# EAGLE schematic F4BY_V2.1.5 (EAGLE 6.3)
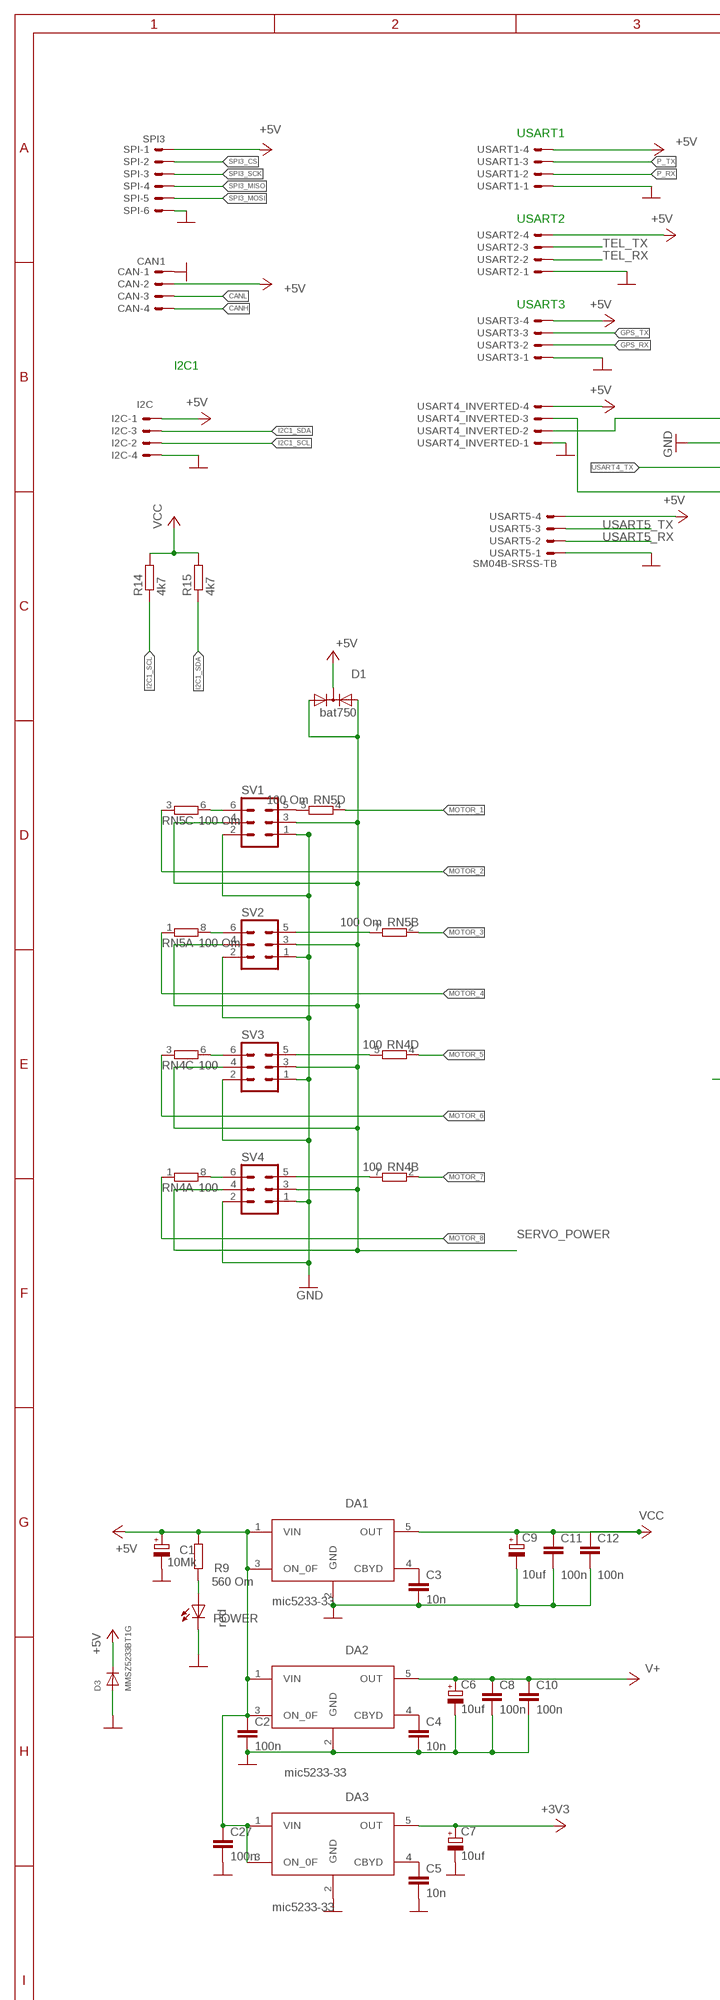
[diagram p0: schematic, sheet 1, part 1 of 2]
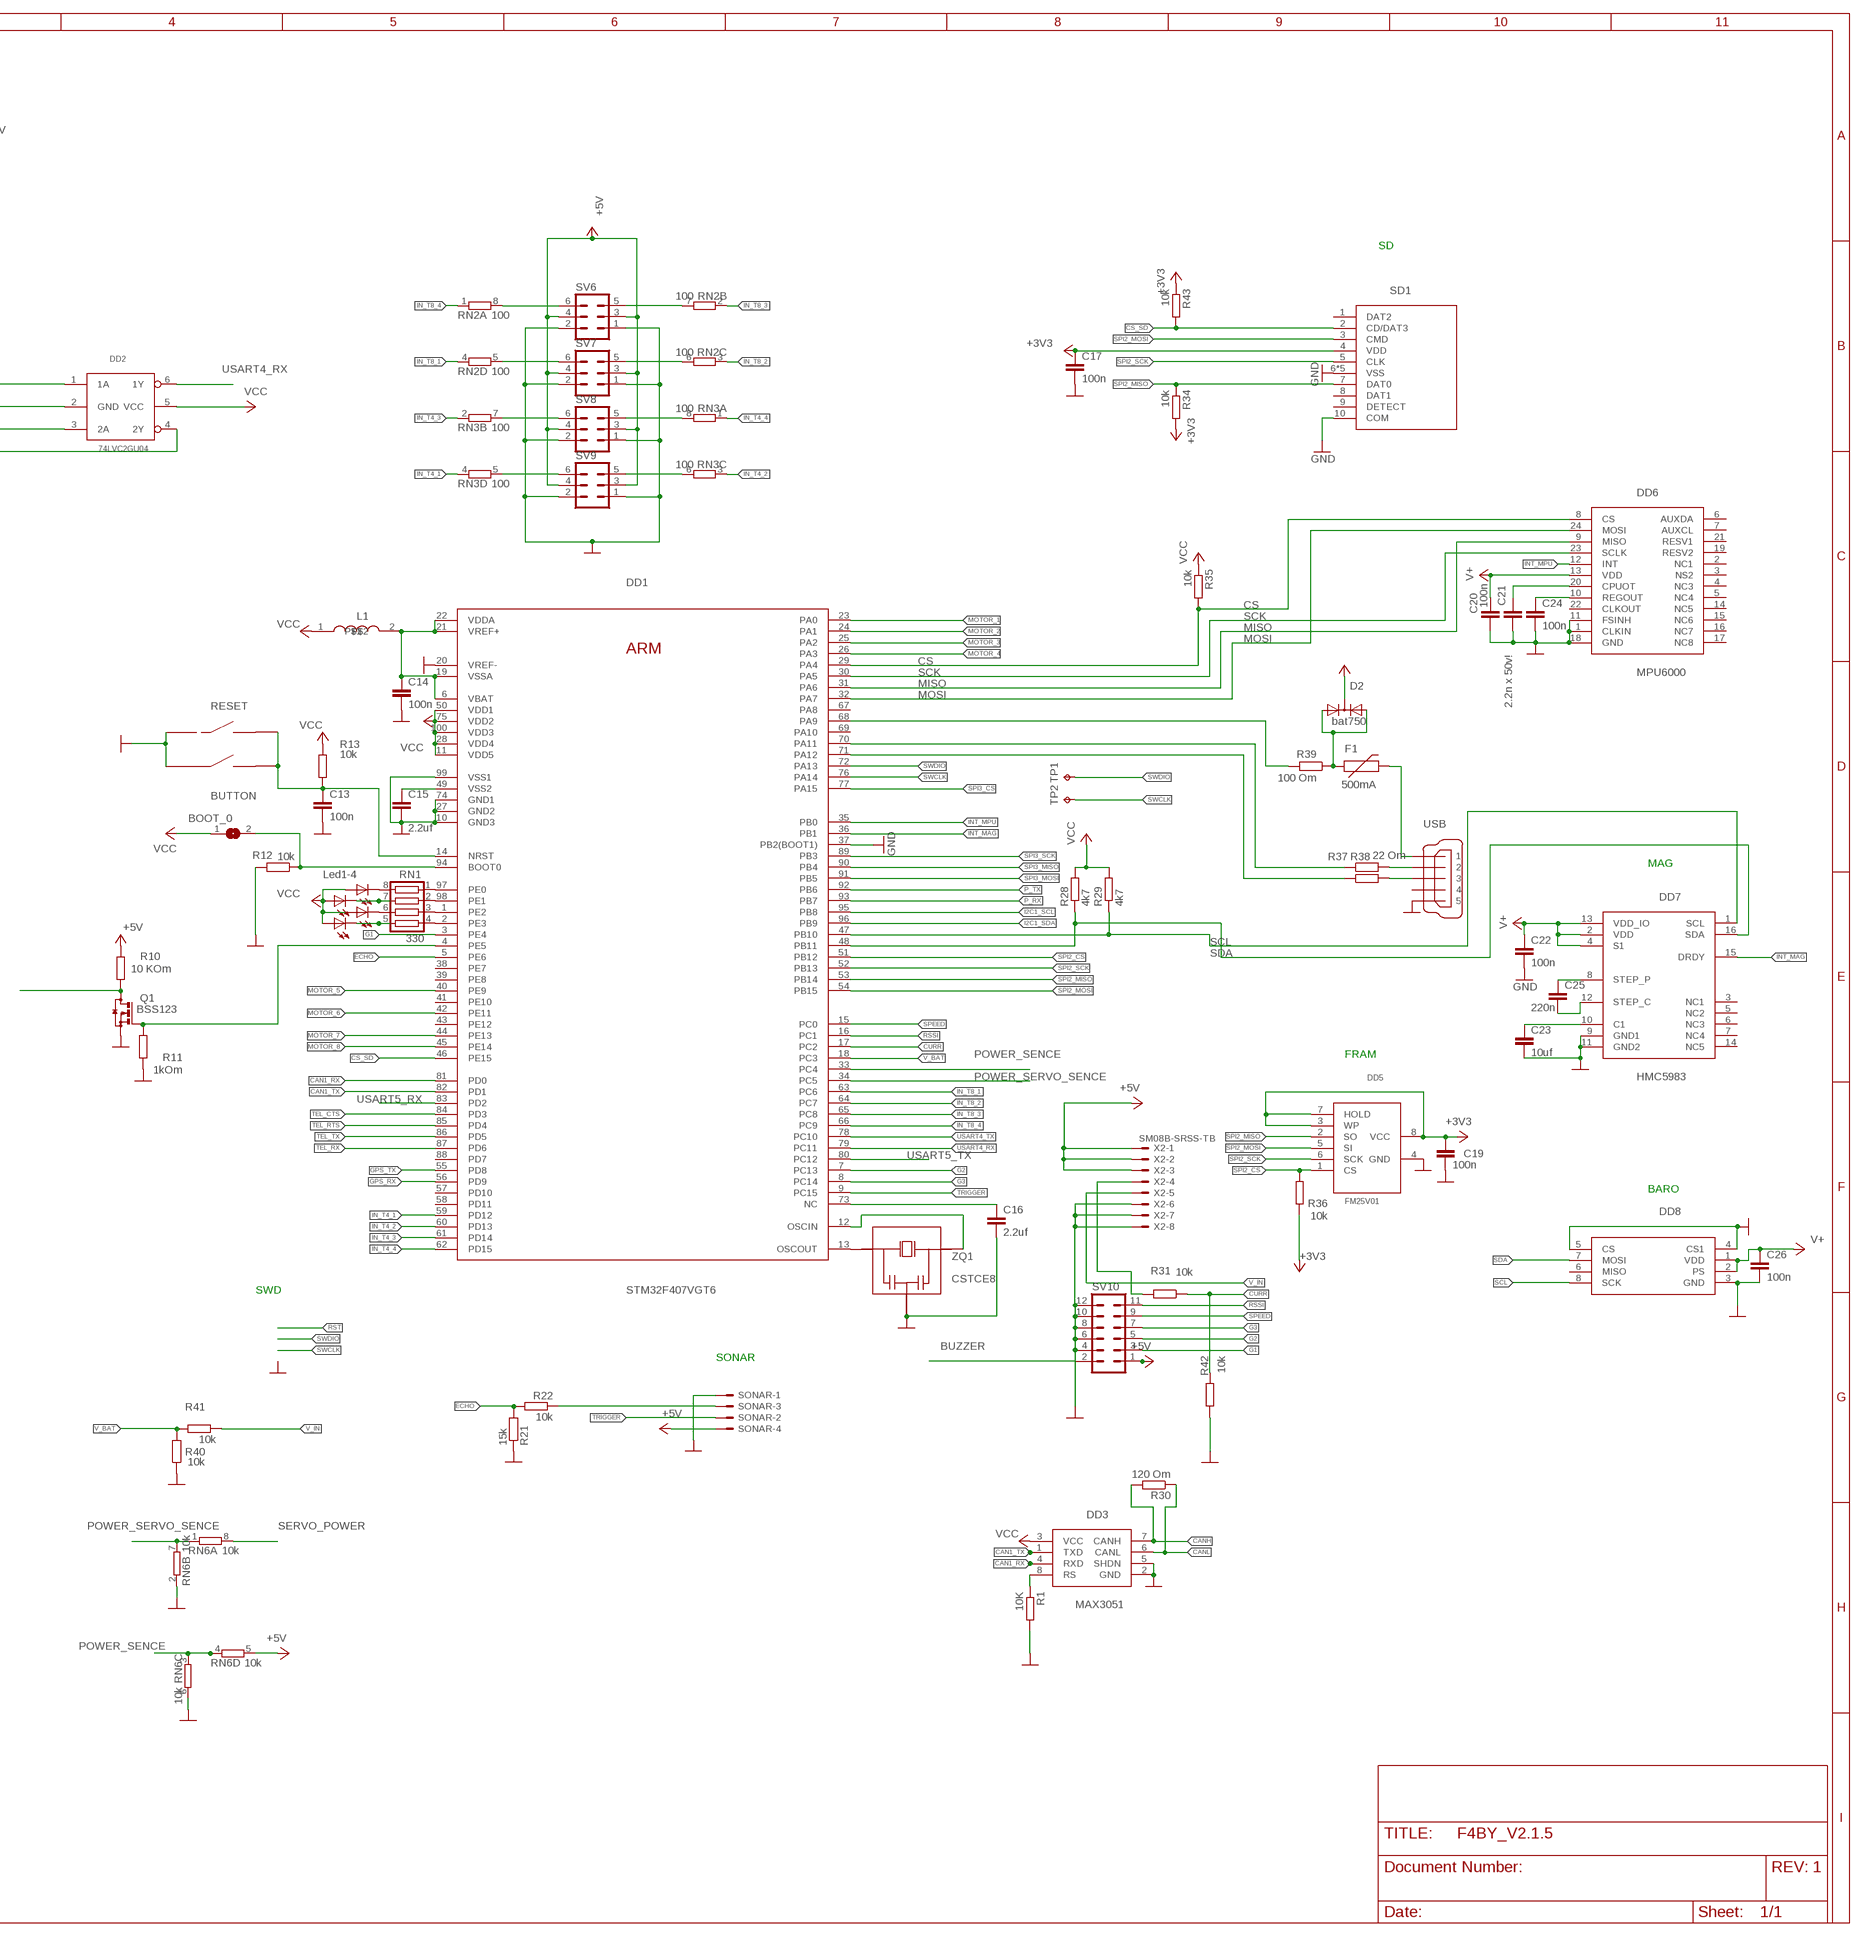
[diagram p1: schematic, sheet 1, part 2 of 2]

## Parts
BOOT_0  SJ  [SJ]
C1  10Mk  CPOL-EUA/3216-18W  [A/3216-18W]
C2  100n  C-EUC0603K  [C0603K]
C3  10n  C-EUC0603K  [C0603K]
C4  10n  C-EUC0603K  [C0603K]
C5  10n  C-EUC0603K  [C0603K]
C6  10uf  CPOL-EUA/3216-18W  [A/3216-18W]
C7  10uf  CPOL-EUA/3216-18W  [A/3216-18W]
C8  100n  C-EUC0603K  [C0603K]
C9  10uf  CPOL-EUA/3216-18W  [A/3216-18W]
C10  100n  C-EUC0603K  [C0603K]
C11  100n  C-EUC0603K  [C0603K]
C12  100n  C-EUC0603K  [C0603K]
C13  100n  C-EUC0603K  [C0603K]
C14  100n  C-EUC0603K  [C0603K]
C15  2.2uf  C-EUC0805  [C0805]
C16  2.2uf  C-EUC0805  [C0805]
C17  100n  C-EUC0603K  [C0603K]
C19  100n  C-EUC0603K  [C0603K]
C20  100n  C-EUC0603K  [C0603K]
C21  2.2n x 50v!  C-EUC0603K  [C0603K]
C22  100n  C-EUC0603K  [C0603K]
C23  10uf  C-EUC0805K  [C0805K]
C24  100n  C-EUC0603K  [C0603K]
C25  220n  C-EUC0603K  [C0603K]
C26  100n  C-EUC0603K  [C0603K]
C27  100n  C-EUC0603K  [C0603K]
CAN  CAN1  SM04B-SRSS-TB  [SM04B-SRSS-TB]
D1  bat750  DIODE-2AC|CASOT23  [SOT23]
D2  bat750  DIODE-2AC|CASOT23  [SOT23]
D3  MMSZ5233BT1G  ADAFRUIT_DIODESOD-123  [ADAFRUIT_SOD-123]
DA1  mic5233-33  3.3  [SOT23-5L]
DA2  mic5233-33  3.3  [SOT23-5L]
DA3  mic5233-33  3.3  [SOT23-5L]
DD1  STM32F407VGT6  STM32F407VET6  [LQFP100]
DD2  74LVC2GU04  [SOT363_PHILIPS]
DD3  MAX3051  [MAX3051]
DD5  FM25V01  W25X40  [SOIC8]
DD6  MPU6000  [JEDEC]
DD7  HMC5983  HMC5883L  [LCC-16]
DD8  MS5611-01BA03  [MS5611-01BA03]
F1  500mA  SPARKFUN_PTCSMD  [SPARKFUN_PTC-1206]
I2C  I2C  SM04B-SRSS-TB  [SM04B-SRSS-TB]
L1  FCM1608  [R0603]
LED1  LED1  LEDCHIPLED_0603  [CHIPLED_0603]
LED2  LED2  LEDCHIPLED_0603  [CHIPLED_0603]
LED3  LEDCHIPLED_0603  [CHIPLED_0603]
LED4  LEDCHIPLED_0603  [CHIPLED_0603]
POWER  red  LEDCHIPLED_0603  [CHIPLED_0603]
Q1  BSS123  [SOT23]
R1  10K  R-EU_R0402  [R0402]
R9  560 Om  R-EU_R0603  [R0603]
R10  10 KOm  R-EU_R0603  [R0603]
R11  1kOm  R-EU_R0603  [R0603]
R12  10k  R-EU_R0603  [R0603]
R13  10k  R-EU_R0603  [R0603]
R14  4k7  R-EU_R0603  [R0603]
R15  4k7  R-EU_R0603  [R0603]
R21  15k  R-EU_R0603  [R0603]
R22  10k  R-EU_R0603  [R0603]
R28  4k7  R-EU_R0603  [R0603]
R29  4k7  R-EU_R0603  [R0603]
R30  120 Om  R-EU_R0603  [R0603]
R31  10k  R-EU_R0603  [R0603]
R34  10k  R-EU_R0603  [R0603]
R35  10k  R-EU_R0603  [R0603]
R36  10k  R-EU_R0603  [R0603]
R37  22 Om  R-EU_R0603  [R0603]
R38  22 Om  R-EU_R0603  [R0603]
R39  100 Om  R-EU_R0603  [R0603]
R40  10k  R-EU_R0603  [R0603]
R41  10k  R-EU_R0603  [R0603]
R42  10k  R-EU_R0603  [R0603]
R43  10k  R-EU_R0603  [R0603]
RESET  BUTTON  [BUTTON]
RN1  330  CTS742C083  [CTS742C083]
RN2  100  4R-N0603-ARC  [0603-ARC]
RN3  100  4R-N0603-ARC  [0603-ARC]
RN4  100  4R-N0603-ARC  [0603-ARC]
RN5  100 Om  4R-N0603-ARC  [0603-ARC]
RN6  10k  4R-N0603-ARC  [0603-ARC]
SD1  MICROCD_MAIN  [MICROSD_MAIN]
SONAR  SM04B-SRSS-TB  [SM04B-SRSS-TB]
SPI  SPI3  SM06B-SRSS-TB  [SM06B-SRSS-TB]
SV1  MA03-2  [MA03-2]
SV2  MA03-2  [MA03-2]
SV3  MA03-2  [MA03-2]
SV4  MA03-2  [MA03-2]
SV6  MA03-2  [MA03-2]
SV7  MA03-2  [MA03-2]
SV8  MA03-2  [MA03-2]
SV9  MA03-2  [MA03-2]
SV10  MA06-2  [MA06-2]
TP1  TPTP08SQ  [TP08SQ]
TP2  TPTP08SQ  [TP08SQ]
USART1  USART1  SM04B-SRSS-TB  [SM04B-SRSS-TB]
USART2  SM04B-SRSS-TB  [SM04B-SRSS-TB]
USART3  SM04B-SRSS-TB  [SM04B-SRSS-TB]
USART4_INVERTED  SM04B-SRSS-TB  [SM04B-SRSS-TB]
USART5  SM04B-SRSS-TB  [SM04B-SRSS-TB]
USB  MINI-USB-32005-201  [32005-201]
X2  SM08B-SRSS-TB  [SM08B-SRSS-TB]
ZQ1  CSTCE8  [CSTCE8]

## Nets
+3V3: C7.+ C17.1 C19.1 DA3.5(OUT) DD5.3(WP) DD5.7(HOLD) DD5.8(VCC) R34.2 R36.1 R43.1 SD1.4(VDD)
+5V: C1.+ C2.1 C27.1 CAN.2 D1.3(C) D2.3(C) D3.C DA1.1(VIN) DA1.3(ON_0F) DA2.1(VIN) DA2.3(ON_0F) DA3.1(VIN) DA3.3(ON_0F) I2C.1 R9.2 R10.2 RN6.5 SONAR.4 SPI.1 SV6.3 SV6.4 SV7.3 SV7.4 SV8.3 SV8.4 SV9.3 SV9.4 SV10.1 USART1.4 USART2.4 USART3.4 USART4_INVERTED.4 USART5.4 X2.1 X2.2 X2.3
BUZZER: Q1.3(D) R10.1 SV10.2
CAN1_RX: DD1.81(PD0) DD3.4(RXD)
CAN1_TX: DD1.82(PD1) DD3.1(TXD)
CANH: CAN.4 DD3.7(CANH) R30.2
CANL: CAN.3 DD3.6(CANL) R30.1
CS: DD1.29(PA4) DD6.8(CS) R35.2
CS_SD: DD1.46(PE15) R43.2 SD1.2(CD/DAT3)
CURR: DD1.17(PC2) R31.1 R42.2
ECHO: DD1.5(PE6) R21.2 R22.2
G1: DD1.3(PE4) SV10.3
G2: DD1.7(PC13) SV10.5
G3: DD1.8(PC14) SV10.7
GND: C1.- C2.2 C3.2 C4.2 C5.2 C6.- C7.- C8.2 C9.- C10.2 C11.2 C12.2 C13.2 C14.2 C15.2 C16.2 C17.2 C19.2 C20.2 C21.2 C22.2 C23.2 C24.2 C26.2 C27.2 CAN.1 D3.A DA1.2(GND) DA2.2(GND) DA3.2(GND) DD1.10(GND3) DD1.20(VREF-) DD1.27(GND2) DD1.37(PB2(BOOT1)) DD1.74(GND1) DD1.99(VSS1) DD2.2(GND) DD3.2(GND) DD3.5(SHDN) DD5.4(GND) DD6.1(CLKIN) DD6.11(FSINH) DD6.18(GND) DD7.9(GND1) DD7.11(GND2) DD8.3(GND) DD8.4(CS1) DD8.5(CS) I2C.4 POWER.C Q1.2(S) R1.2 R11.1 R12.2 R21.1 R40.1 R42.1 RESET.1 RESET.3 RN6.2 RN6.6 SD1.6(VSS) SD1.10(COM) SD1.11(VSS) SD1.12(VSS) SD1.13(VSS) SD1.14(VSS) SONAR.1 SPI.6 SV1.1 SV1.2 SV2.1 SV2.2 SV3.1 SV3.2 SV4.1 SV4.2 SV6.1 SV6.2 SV7.1 SV7.2 SV8.1 SV8.2 SV9.1 SV9.2 SV10.4 SV10.6 SV10.8 SV10.10 SV10.12 USART1.1 USART2.1 USART3.1 USART4_INVERTED.1 USART5.1 USB.5 X2.6 X2.7 X2.8 ZQ1.2
GPS_RX: DD1.56(PD9) USART3.2
GPS_TX: DD1.55(PD8) USART3.3
I2C1_SCL: DD1.95(PB8) I2C.2 R14.1
I2C1_SDA: DD1.96(PB9) I2C.3 R15.1
IN_T4_1: DD1.59(PD12) RN3.4
IN_T4_2: DD1.60(PD13) RN3.3
IN_T4_3: DD1.61(PD14) RN3.2
IN_T4_4: DD1.62(PD15) RN3.1
IN_T8_1: DD1.63(PC6) RN2.4
IN_T8_2: DD1.64(PC7) RN2.3
IN_T8_3: DD1.65(PC8) RN2.2
IN_T8_4: DD1.66(PC9) RN2.1
INT_MAG: DD1.36(PB1) DD7.15(DRDY)
INT_MPU: DD1.35(PB0) DD6.12(INT)
MISO: DD1.31(PA6) DD6.9(MISO)
MOSI: DD1.32(PA7) DD6.24(MOSI)
MOTOR_1: DD1.23(PA0) RN5.4
MOTOR_2: DD1.24(PA1) RN5.3
MOTOR_3: DD1.25(PA2) RN5.2
MOTOR_4: DD1.26(PA3) RN5.1
MOTOR_5: DD1.40(PE9) RN4.4
MOTOR_6: DD1.42(PE11) RN4.3
MOTOR_7: DD1.44(PE13) RN4.2
MOTOR_8: DD1.45(PE14) RN4.1
N$1: DD1.13(OSCOUT) ZQ1.1
N$2: DD1.98(PE1) RN1.2
N$3: DD1.1(PE2) RN1.3
N$4: POWER.A R9.1
N$5: DD1.2(PE3) RN1.4
N$6: DD1.97(PE0) RN1.1
N$7: LED3.C RN1.7
N$8: LED4.C RN1.8
N$9: RN2.8 SV6.6
N$10: LED2.C RN1.6
N$11: DD1.68(PA9) R39.2
N$12: DD1.12(OSCIN) ZQ1.3
N$13: DD3.8(RS) R1.1
N$14: LED1.C RN1.5
N$15: C3.1 DA1.4(CBYD)
N$16: RN2.7 SV6.5
N$17: RN2.5 SV7.6
N$18: RN3.7 SV8.6
N$19: C21.1 DD6.20(CPUOT)
N$21: RN3.5 SV9.6
N$22: C24.1 DD6.10(REGOUT)
N$23: RN3.6 SV9.5
N$24: RN3.8 SV8.5
N$25: RN2.6 SV7.5
N$26: C23.1 DD7.10(C1)
N$27: C25.2 DD7.12(STEP_C)
N$28: C25.1 DD7.8(STEP_P)
N$29: RN5.5 SV1.5
N$30: F1.2 USB.1
N$31: DD2.1(1A) USART4_INVERTED.2
N$33: RN5.6 SV1.6
N$34: R31.2 X2.4
N$35: C4.1 DA2.4(CBYD)
N$36: C5.1 DA3.4(CBYD)
N$38: DD2.4(2Y) USART4_INVERTED.3
N$39: RN5.7 SV2.5
N$40: C14.1 DD1.6(VBAT) DD1.19(VSSA) DD1.21(VREF+) DD1.22(VDDA) L1.2
N$41: DD1.70(PA11) R37.1
N$42: DD1.71(PA12) R38.1
N$43: R37.2 USB.2
N$44: R38.2 USB.3
N$45: RN5.8 SV2.6
N$46: RN4.5 SV3.5
N$47: D2.1(A1) D2.2(A2) F1.1 R39.1
N$48: RN4.7 SV4.5
N$49: RN4.6 SV3.6
N$50: RN4.8 SV4.6
N$51: DD1.4(PE5) Q1.1(G) R11.2
N$53: C15.1 DD1.49(VSS2)
N$55: R22.1 SONAR.3
N$61: BOOT_0.2 DD1.94(BOOT0) R12.1
N$77: C16.1 DD1.73(NC)
P_RX: DD1.93(PB7) USART1.2
P_TX: DD1.92(PB6) USART1.3
POWER_SENCE: DD1.33(PC4) RN6.3 RN6.4
POWER_SERVO_SENCE: DD1.34(PC5) RN6.1 RN6.7
RSSI: DD1.16(PC1) SV10.11
RST: C13.1 DD1.14(NRST) R13.2 RESET.2 RESET.4
SCK: DD1.30(PA5) DD6.23(SCLK)
SCL: DD1.47(PB10) DD7.1(SCL) DD8.8(SCK) R29.1
SDA: DD1.48(PB11) DD7.16(SDA) DD8.7(MOSI) R28.1
SERVO_POWER: D1.1(A1) D1.2(A2) RN6.8 SV1.3 SV1.4 SV2.3 SV2.4 SV3.3 SV3.4 SV4.3 SV4.4
SPEED: DD1.15(PC0) SV10.9
SPI2_CS: DD1.51(PB12) DD5.1(CS) R36.2
SPI2_MISO: DD1.53(PB14) DD5.2(SO) R34.1 SD1.7(DAT0)
SPI2_MOSI: DD1.54(PB15) DD5.5(SI) SD1.3(CMD)
SPI2_SCK: DD1.52(PB13) DD5.6(SCK) SD1.5(CLK)
SPI3_CS: DD1.77(PA15) SPI.2
SPI3_MISO: DD1.90(PB4) SPI.4
SPI3_MOSI: DD1.91(PB5) SPI.5
SPI3_SCK: DD1.89(PB3) SPI.3
SWCLK: DD1.76(PA14)
SWDCLK: TP2.TP
SWDIO: DD1.72(PA13) TP1.TP
TEL_CTS: DD1.84(PD3)
TEL_RTS: DD1.85(PD4)
TEL_RX: DD1.87(PD6) USART2.2
TEL_TX: DD1.86(PD5) USART2.3
TRIGGER: DD1.9(PC15) SONAR.2
USART4_RX: DD1.79(PC11) DD2.6(1Y)
USART4_TX: DD1.78(PC10) DD2.3(2A)
USART5_RX: DD1.83(PD2) USART5.2
USART5_TX: DD1.80(PC12) USART5.3
V+: C6.+ C8.1 C10.1 C20.1 C22.1 C26.1 DA2.5(OUT) DD6.13(VDD) DD7.2(VDD) DD7.4(S1) DD7.13(VDD_IO) DD8.1(VDD) DD8.2(PS)
V_BAT: DD1.18(PC3) R40.2 R41.2
V_IN: R41.1 X2.5
VCC: BOOT_0.1 C9.+ C11.1 C12.1 DA1.5(OUT) DD1.11(VDD5) DD1.28(VDD4) DD1.50(VDD1) DD1.75(VDD2) DD1.100(VDD3) DD2.5(VCC) DD3.3(VCC) L1.1 LED1.A LED2.A LED3.A LED4.A R13.1 R14.2 R15.2 R28.2 R29.2 R35.1
Unconnected: DD1.38(PE7) DD1.39(PE8) DD1.41(PE10) DD1.43(PE12) DD1.57(PD10) DD1.58(PD11) DD1.67(PA8) DD1.69(PA10) DD1.88(PD7) DD6.2(NC1) DD6.3(NS2) DD6.4(NC3) DD6.5(NC4) DD6.6(AUXDA) DD6.7(AUXCL) DD6.14(NC5) DD6.15(NC6) DD6.16(NC7) DD6.17(NC8) DD6.19(RESV2) DD6.21(RESV1) DD6.22(CLKOUT) DD7.3(NC1) DD7.5(NC2) DD7.6(NC3) DD7.7(NC4) DD7.14(NC5) DD8.6(MISO) SD1.1(DAT2) SD1.8(DAT1) SD1.9(DETECT) USB.4

## Notes on the sheet
- USART1
- USART2
- SD
- USART3
- I2C1
- MAG
- Led1-4
- FRAM
- BARO
- SWD
- SONAR
- 1

## Library data of the parts
BOOT_0 = jumper:SJ: SMD solder JUMPER
C1 C6 C7 C9 = resistor:CPOL-EU: POLARIZED CAPACITOR, European symbol
C2-C5 C8 C10-C17 C19-C27 = resistor:C-EU: CAPACITOR, European symbol
CAN USART1 USART3 = con-jst1:?M04B-SRSS-TB: Disconnectable Crimp style connector, 1.0mm pitch 4 contacts
D1 D2 = diode:DIODE-2AC|CA: Dual DIODE Anode-Cathode|Cathode-Anode
D3 = APM_v252_m2:ADAFRUIT_DIODE: Diode SMADIODE - SMA Surface Mount Package 20V 1A Schottky Diode Digikey: 641-1014-6-ND DO-1N4148 - Through Hole Small Current Diode SOD-123 20V 1 A (.5mV Vf) Schottky Diode - Digikey: MBRX120TPMSCT-ND SOD-323 10V 570mA (.38mV Vf, 3ns) Schottky Diode - Digikey: ZLLS410CT-ND SOD-523 30V 30mA Schottky Diode (RB751S-40TE61) - Digikey: RB751S-40TE61CT-ND SOT23-R/W - SOT23 Package (R = Solder Paste/Reflow Ovens, W = Hand-Soldering) BAT54Film 40V 300mA - Digikey: 497-7162-1-ND
DA1-DA3 = pepelac:3.3
DD1 = pepelac:STM32F407VET6
DD2 = pepelac:74LVC2GU04
DD3 = pepelac:MAX3051
DD5 = pepelac:W25X40
DD6 = pepelac:MPU6000
DD7 = pepelac:HMC5883L
DD8 = pepelac:MS5611-01BA03
F1 = APM_v252_m2:SPARKFUN_PTC: Resettable Fuse PTC Resettable Fuse. Spark Fun Electronics SKU : COM-08357
I2C SONAR USART4_INVERTED = pepelac:?M04B-SRSS-TB: Disconnectable Crimp style connector, 1.0mm pitch 4 contacts
L1 = pepelac:FCM1608
LED1-LED4 POWER = led:LED: LED OSRAM: - CHIPLED LG R971, LG N971, LY N971, LG Q971, LY Q971, LO R971, LY R971 LH N974, LH R974 LS Q976, LO Q976, LY Q976 LO Q996 - Hyper CHIPLED LW Q18S LB Q993, LB Q99A, LB R99A - SideLED LS A670, LO A670, LY A670, LG A670, LP A670 LB A673, LV A673, LT A673, LW A673 LH A674 LY A675 LS A676, LA A676, LO A676, LY A676, LW A676 LS A679, LY A679, LG A679 - Hyper Micro SIDELED® LS Y876, LA Y876, LO Y876, LY Y876 LT Y87S - SmartLED LW L88C, LW L88S LB L89C, LB L89S, LG L890 LS L89K, LO L89K, LY L89K LS L896, LA L896, LO L896, LY L896 - TOPLED LS T670, LO T670, LY T670, LG T670, LP T670 LSG T670, LSP T670, LSY T670, LOP T670, LYG T670 LG T671, LOG T671, LSG T671 LB T673, LV T673, LT T673, LW T673 LH T674 LS T676, LA T676, LO T676, LY T676, LB T676, LH T676, LSB T676, LW T676 LB T67C, LV T67C, LT T67C, LS T67K, LO T67K, LY T67K, LW E67C LS E67B, LA E67B, LO E67B, LY E67B, LB E67C, LV E67C, LT E67C LW T67C LS T679, LY T679, LG T679 LS T770, LO T770, LY T770, LG T770, LP T770 LB T773, LV T773, LT T773, LW T773 LH T774 LS E675, LA E675, LY E675, LS T675 LS T776, LA T776, LO T776, LY T776, LB T776 LHGB T686 LT T68C, LB T68C - Hyper Mini TOPLED® LB M676 - Mini TOPLED Santana® LG M470 LS M47K, LO M47K, LY M47K Source: http://www.osram.convergy.de LUXEON: - LUMILED® LXK2-PW12-R00, LXK2-PW12-S00, LXK2-PW14-U00, LXK2-PW14-V00 LXK2-PM12-R00, LXK2-PM12-S00, LXK2-PM14-U00 LXK2-PE12-Q00, LXK2-PE12-R00, LXK2-PE12-S00, LXK2-PE14-T00, LXK2-PE14-U00 LXK2-PB12-K00, LXK2-PB12-L00, LXK2-PB12-M00, LXK2-PB14-N00, LXK2-PB14-P00, LXK2-PB14-Q00 LXK2-PR12-L00, LXK2-PR12-M00, LXK2-PR14-Q00, LXK2-PR14-R00 LXK2-PD12-Q00, LXK2-PD12-R00, LXK2-PD12-S00 LXK2-PH12-R00, LXK2-PH12-S00 LXK2-PL12-P00, LXK2-PL12-Q00, LXK2-PL12-R00 Source: www.luxeon.com KINGBRIGHT: KA-3528ASYC Source: www.kingbright.com
Q1 = transistor-small-signal:BSS123: N-CHANNEL MOS FET
R1 R9-R15 R21 R22 R28-R31 R34-R43 = resistor:R-EU_: RESISTOR, European symbol
RESET = pepelac:BUTTON
RN1 = resistor-net:CTS742C083: Chip Resistor Array 4 Single Resistor Source: http://www.ctscorp.com/components/Datasheets/CTSChipArrayDs.pdf; OC_FARNELL: unknown; OC_NEWARK: unknown
RN2-RN6 = resistor-dil:4R-N: Array Chip Resistor Source: RS Component / Phycomp; OC_FARNELL: unknown; OC_NEWARK: unknown
SD1 = pepelac:MICROCD_MAIN
SPI = con-jst1:?M06B-SRSS-TB: Disconnectable Crimp style connector, 1.0mm pitch 6 contacts
SV1-SV4 SV6-SV9 = con-lstb:MA03-2: PIN HEADER; OC_FARNELL: unknown; OC_NEWARK: unknown
SV10 = con-lstb:MA06-2: PIN HEADER; OC_FARNELL: unknown; OC_NEWARK: unknown
TP1 TP2 = testpad:TP: Test pad
USART2 USART5 = con-jst2:?M04B-SRSS-TB: Disconnectable Crimp style connector, 1.0mm pitch 4 contacts
USB = con-cypressindustries:MINI-USB-: MINI USB-B Conector Source: www.cypressindustries.com; OC_FARNELL: unknown; OC_NEWARK: unknown
X2 = con-jst2:?M08B-SRSS-TB: Disconnectable Crimp style connector, 1.0mm pitch 8 contacts
ZQ1 = pepelac:CSTCE8

## Net classes
0 Def: width 0.406 mm, clearance 0.152 mm